# EAGLE design Solar Power Management ESP32 (EAGLE 9.6.2)
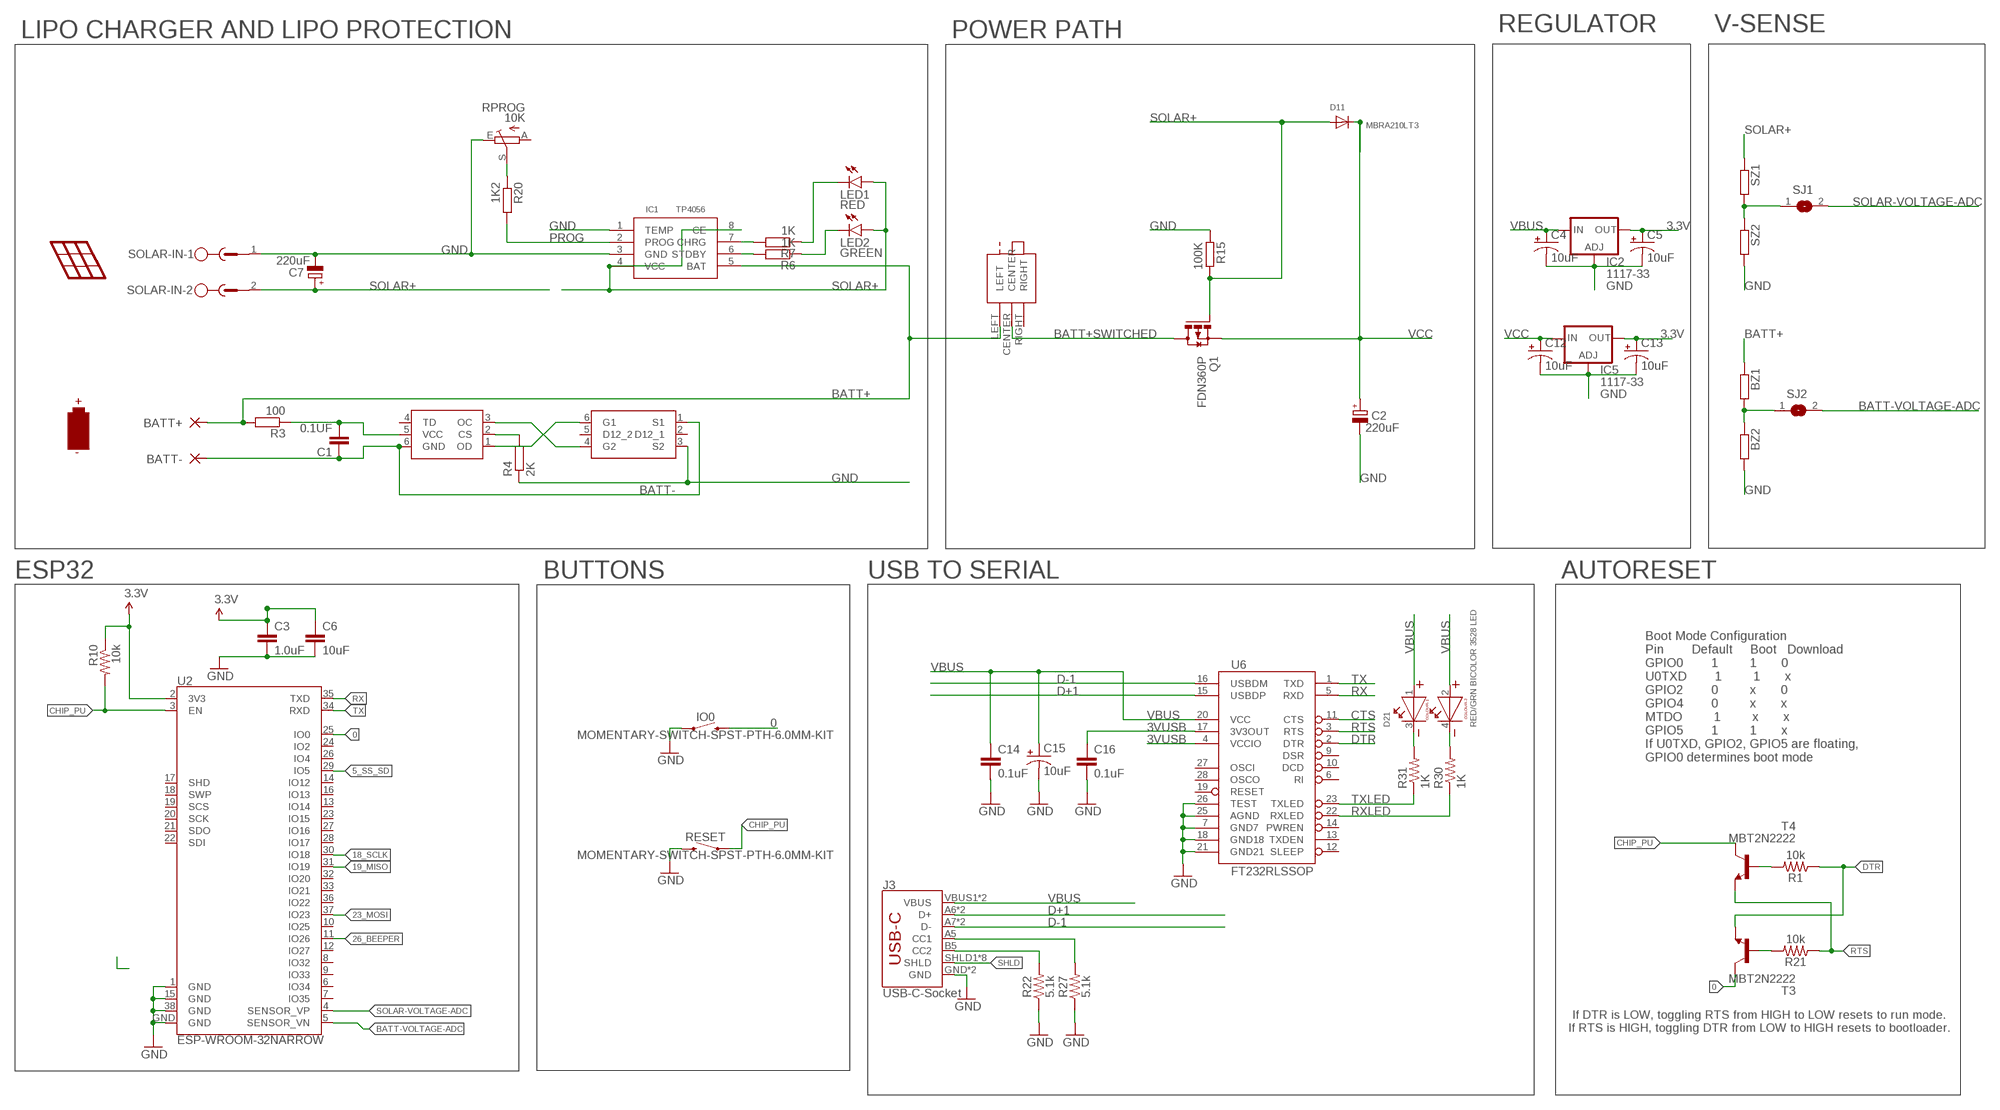
[diagram p0: schematic, sheet 1, part 1 of 2]
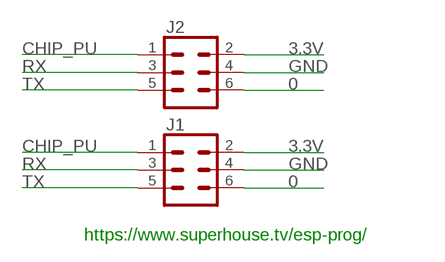
[diagram p1: schematic, sheet 1, part 2 of 2]

## Parts
BATT+  3,81/1,4  [3,81/1,4]
BATT-  3,81/1,4  [3,81/1,4]
BZ1  R-EU_R1206  [R1206]
BZ2  R-EU_R1206  [R1206]
C1  0.1UF  C-EUC1206  [C1206]
C2  220uF  CPOL-EUE3.5-8  [E3,5-8]
C3  1.0uF  1.0UF-1206-50V-10%  [1206]
C4  10uF  CAP_POL1206  [EIA3216]
C5  10uF  CAP_POL1206  [EIA3216]
C6  10uF  10UF-1206-6.3V-20%  [1206]
C7  220uF  CPOL-EUE3.5-8  [E3,5-8]
C12  10uF  CAP_POL1206  [EIA3216]
C13  10uF  CAP_POL1206  [EIA3216]
C14  0.1uF  CAP0603-CAP  [0603-CAP]
C15  10uF  CAP_POL1206  [EIA3216]
C16  0.1uF  CAP0603-CAP  [0603-CAP]
D11  MBRA210LT3  DIODESMA  [SMADIODE]
D21  RED/GRN BICOLOR 3528 LED  WL-SBTW-150141RB73100-R&B  [3528]
IC1  TP4056  [SOP-8]
IC2  1117-33  LD117AS33TR  [SOT223]
IC5  1117-33  LD117AS33TR  [SOT223]
IO0  MOMENTARY-SWITCH-SPST-PTH-6.0MM-KIT  [TACTILE_SWITCH_PTH_6.0MM_KIT]
J1  CONN_03X2SHROUD  [2X3-SHROUDED]
J2  CONN_03X2SHROUD  [2X3-SHROUDED]
J3  USB-C-Socket  USB_C16PIN  [USB-C-16P]
LED1  RED  LEDCHIPLED_1206  [CHIPLED_1206]
LED2  GREEN  LEDCHIPLED_1206  [CHIPLED_1206]
Q1  FDN360P  [SUPER-SOT3]
R1  10k  10KOHM-0603-1/10W-1%  [0603]
R3  100  R-EU_R1206  [R1206]
R4  2K  R-EU_R1206  [R1206]
R6  1K  R-EU_R1206  [R1206]
R7  1K  R-EU_R1206  [R1206]
R10  10k  R-US_R1206  [R1206]
R15  100K  R-EU_R1206  [R1206]
R20  1K2  R-EU_R1206  [R1206]
R21  10k  10KOHM-0603-1/10W-1%  [0603]
R22  5.1k  5.1KOHM5.1KOHM-0603-1/10W-1%  [0603@1]
R27  5.1k  5.1KOHM5.1KOHM-0603-1/10W-1%  [0603@1]
R30  1K  RESISTOR0603-RES  [0603-RES]
R31  1K  RESISTOR0603-RES  [0603-RES]
RESET  MOMENTARY-SWITCH-SPST-PTH-6.0MM-KIT  [TACTILE_SWITCH_PTH_6.0MM_KIT]
RPROG  10K  TRIM_EU-B25P  [B25P]
SJ1  SJ  [SJ]
SJ2  SJ  [SJ]
SOLAR-IN  MSTBV2  [MSTBV2]
SZ1  R-EU_R1206  [R1206]
SZ2  R-EU_R1206  [R1206]
T3  MBT2N2222  MMBT2222ALT1-NPN-SOT23-BEC  [SOT23-BEC]
T4  MBT2N2222  MMBT2222ALT1-NPN-SOT23-BEC  [SOT23-BEC]
U2  ESP-WROOM-32NARROW  [ESP-WROOM-32-NARROW]
U6  FT232RLSSOP  [SSOP28DB]
U$1  FS312F-G  [SOT23-6]
U$2  FS8205  [SOT23-6]
U$3  XKBENTERPRISESS-12D11G5R  [XKBENTERPRISESS-12D11G5R]

## Nets
0: IO0.3 J1.6 J2.6 T3.C U2.25(IO0)
3.3V: C3.1 C5.A(+) C6.1 C13.A(+) IC2.4(OUT) IC5.4(OUT) J1.2 J2.2 R10.1 U2.2(3V3)
3VUSB: C16.1 U6.4(VCCIO) U6.17(3V3OUT)
5_SS_SD: U2.29(IO5)
18_SCLK: U2.30(IO18)
19_MISO: U2.31(IO19)
23_MOSI: U2.37(IO23)
26_BEEPER: U2.11(IO26)
BATT+: BATT+.1(P) BZ1.1 IC1.5(BAT) R3.2 U$3.LEFT
BATT+SWITCHED: Q1.3(D) U$3.CENTER
BATT-: BATT-.1(P) C1.1 U$1.6(GND) U$2.1(S1)
BATT-VOLTAGE-ADC: BZ1.2 BZ2.1 SJ2.1 SJ2.2 U2.5(SENSOR_VN)
CC1: J3.A5(CC1) R27.2
CC2: J3.B5(CC2) R22.2
CHG: IC1.7(CHRG) R7.2
CHIP_PU: J1.1 J2.1 R10.2 RESET.1 T4.C U2.3(EN)
CTS: U6.11(CTS)
D+1: J3.A6(D+) J3.B6(D+) U6.15(USBDP)
D-1: J3.A7(D-) J3.B7(D-) U6.16(USBDM)
DTR: R1.1 T3.E U6.2(DTR)
GND: BZ2.2 C2.- C3.2 C4.C(-) C5.C(-) C6.2 C7.- C12.C(-) C13.C(-) C14.2 C15.C(-) C16.2 IC1.1(TEMP) IC1.3(GND) IC2.1(ADJ) IC5.1(ADJ) IO0.1 J1.4 J2.4 J3.GND J3.GND2(GND) R4.1 R15.1 R22.1 R27.1 RESET.3 RPROG.E SOLAR-IN.1 SZ2.2 U2.1(GND) U2.15(GND) U2.38(GND) U2.GND U6.7(GND7) U6.18(GND18) U6.21(GND21) U6.25(AGND) U6.26(TEST) U$2.3(S2)
LEDCHR: LED1.C R7.1
LEDSBY: LED2.C R6.1
N$1: R4.2 U$1.2(CS)
N$4: R1.2 T4.B
N$6: R21.2 T3.B
N$7: D21.4(C2) R30.2
N$9: D21.3(C1) R31.2
N$12: R20.1 RPROG.S
OC: U$1.3(OC) U$2.4(G2)
OD: U$1.1(OD) U$2.6(G1)
PROG: IC1.2(PROG) R20.2
RTS: R21.1 T4.E U6.3(RTS)
RX: J1.3 J2.3 U2.35(TXD) U6.5(RXD)
RXLED: R30.1 U6.22(RXLED)
SHLD: J3.SHLD1(SHLD) J3.SHLD2(SHLD) J3.SHLD3(SHLD) J3.SHLD4(SHLD) J3.SHLD5(SHLD) J3.SHLD6(SHLD) J3.SHLD7(SHLD) J3.SHLD8(SHLD)
SOLAR+: C7.+ D11.A IC1.4(VCC) IC1.8(CE) LED1.A LED2.A Q1.1(G) R15.2 SOLAR-IN.2 SZ1.1
SOLAR-VOLTAGE-ADC: SJ1.1 SJ1.2 SZ1.2 SZ2.1 U2.4(SENSOR_VP)
STANDBY: IC1.6(STDBY) R6.2
TX: J1.5 J2.5 U2.34(RXD) U6.1(TXD)
TXLED: R31.1 U6.23(TXLED)
VBUS: C4.A(+) C14.1 C15.A(+) D21.1(A1) D21.2(A2) IC2.3(IN) J3.VBUS1(VBUS) J3.VBUS2(VBUS) U6.20(VCC)
VCC: C2.+ C12.A(+) D11.C IC5.3(IN) Q1.2(S)
VCC-PROT: C1.2 R3.1 U$1.5(VCC)
Unconnected: RPROG.A U2.6(IO34) U2.7(IO35) U2.8(IO32) U2.9(IO33) U2.10(IO25) U2.12(IO27) U2.13(IO14) U2.14(IO12) U2.16(IO13) U2.17(SHD) U2.18(SWP) U2.19(SCS) U2.20(SCK) U2.21(SDO) U2.22(SDI) U2.23(IO15) U2.24(IO2) U2.26(IO4) U2.27(IO16) U2.28(IO17) U2.32(IO20) U2.33(IO21) U2.36(IO22) U6.6(RI) U6.9(DSR) U6.10(DCD) U6.12(SLEEP) U6.13(TXDEN) U6.14(PWREN) U6.19(RESET) U6.27(OSCI) U6.28(OSCO) U$1.4(TD) U$2.2(D12_1) U$2.5(D12_2) U$3.RIGHT

## Notes on the sheet
- LIPO CHARGER AND LIPO PROTECTION | POWER PATH | REGULATOR | V-SENSE
- https://www.superhouse.tv/esp-prog/
- +
- -
- ESP32 | BUTTONS | USB TO SERIAL | AUTORESET
- Boot Mode Configuration
  Pin        Default     Boot   Download
  GPIO0        1         1       0
  U0TXD        1         1       x
  GPIO2        0         x       0
  GPIO4        0         x       x
  MTDO         1         x       x
  GPIO5        1         1       x
  If U0TXD, GPIO2, GPIO5 are floating, 
  GPIO0 determines boot mode
- If DTR is LOW, toggling RTS from HIGH to LOW resets to run mode.
  If RTS is HIGH, toggling DTR from LOW to HIGH resets to bootloader.

## Library data of the parts
BATT+ BATT- = wirepad:3,81/1,4: THROUGH-HOLE PAD
BZ1 BZ2 R3 R4 R6 R7 R15 R20 SZ1 SZ2 = rcl:R-EU_: RESISTOR, European symbol; SPICEPREFIX: R
C1 = rcl:C-EU: CAPACITOR, European symbol; SPICEPREFIX: C
C2 C7 = resistor:CPOL-EU: POLARIZED CAPACITOR, European symbol
C3 = SparkFun-Capacitors:1.0UF: 1µF ceramic capacitors A capacitor is a passive two-terminal electrical component used to store electrical energy temporarily in an electric field.; PROD_ID: CAP-09822
C4 C5 C12 C13 C15 = SparkFun:CAP_POL: Capacitor Polarized These are standard SMD and PTH capacitors. Normally 10uF, 47uF, and 100uF in electrolytic and tantalum varieties. Always verify the external diameter of the through hole cap, it varies with capacity, voltage, and manufacturer. The EIA devices should be standard.
C6 = SparkFun-Capacitors:10UF: 10.0µF ceramic capacitors A capacitor is a passive two-terminal electrical component used to store electrical energy temporarily in an electric field.; PROD_ID: CAP-10057
C14 C16 = SparkFun:CAP: Capacitor Standard 0603 ceramic capacitor, and 0.1" leaded capacitor.
D11 = microbuilder:DIODE: Diode SMADIODE - SMA Surface Mount Package 20V 1A Schottky Diode Digikey (500mV @ 1A, 500uA Vr @ 20V): 641-1014-6-ND 10V 2A Schottky Diode Digikey (350mV @ 2A, 700uA Vr @ 10V): MBRA210LT3 SOD-123 30V 200mA (800mV Vf, 2uA Vr @ 25V) Schottky Diode (very fast switching for boost, etc.) - Digikey: BAT54T1GOSTR-ND 30V 500mA (430mV Vf, 130uA Vr @ 30V) Schottky Diode - Digikey: B0530W-FDICT-ND MBR120 1A 20V (0.34Vf) Schottky Diode - Digikey: MBR120VLSFT1GOSCT-ND SOD-323 10V 570mA (380mV Vf, 3ns) Schottky Diode - Digikey: ZLLS410CT-ND 1N4148WS - 75V 150mA (1V Vf @ 10mA, 4ns) Simple Diode - Digikey: 1N4148WSFSCT-ND, Mouser: 512-1N4148WS SOD-523 BAT54 30V 200mA Schottky (0.8 Vf @ 100mA, 5ns) - Digikey: BAT54XV2CT-ND 30V 30mA Schottky Diode (RB751S-40TE61) - Digikey: RB751S-40TE61CT-ND SOT23-R/W - SOT23 Package (R = Solder Paste/Reflow Ovens, W = Hand-Soldering) BAT54Film 40V 300mA - Digikey: 497-7162-1-ND DO-1N4148 Through Hole Small Current Diode (any model)
D21 = Wurth_Elektronik_Optoelectronics_rev15c:WL-SBTW: SMD bi-color TOP LED Characteristics Low energy consumption High reliability Low current requirement Fast switching No UV/IR radiation None diffused lens Black surface Compact package outline Applications Flat backlight for LCDs, switches and symbols Decorative lighting <http://katalog.we-online.de/media/images/eipal/WL-SBTW_pf2.jpg> Details see: http://katalog.we-online.de/en/led/WL-SBTW?m Updated 2015-04-10 2015 (C) Wurth Elektronik; COMPANY-URL: http://www.we-online.de; CREATED-BY: Christin Otto; CREATED-DATE: APR 2013; DATASHEET-URL: http://katalog.we-online.de/en/led/WL-SBTW?m=t&sq=sbtw&sp=&sp=http%3A%2F%2Fwww.we-online.de%2Fweb%2Fen%2Felectronic_components%2Fsearchpage_PBS.php%3Fsearch%3Dsbtw#vs_t2:2; MANUFACTURER: Würth Elektronik eiSos GmbH
IC1 = TP4056:TP4056
IC2 IC5 = v-reg:LD117A?*: Low drop fixed and adjustable positive voltage regulators 1 A Source: http://www.st.com/stonline/products/literature/ds/7194/ld1117axx.pdf
IO0 RESET = SparkFun-Switches:MOMENTARY-SWITCH-SPST: Momentary Switch (Pushbutton) - SPST Normally-open (NO) SPST momentary switches (buttons, pushbuttons). Variants PTH-12MM - 12mm square, through-hole Momentary Pushbutton Switch - 12mm Square <https://www.sparkfun.com/products/9190> (COM-09190) PTH-6.0MM, PTH-6.0MM-KIT - 6.0mm square, through-hole Mini Pushbutton Switch <https://www.sparkfun.com/products/97> (COM-00097) KIT package intended for soldering kit's - only one side of pads' copper is exposed. PTH-RIGHT-ANGLE-KIT - Right-angle, through-hole Right Angle Tactile Button <https://www.sparkfun.com/products/10791> - Used on SparkFun BigTime Watch Kit <https://www.sparkfun.com/products/11734> SMD-12MM - 12mm square, surface-mount Tactile Button - SMD (12mm) <https://www.sparkfun.com/products/12993> (COM-12993) Used on SparkFun PicoBoard <https://www.sparkfun.com/products/11888> SMD-4.5MM - 4.5mm Square Trackball Switch Used on SparkFun Blackberry Trackballer Breakout <https://www.sparkfun.com/products/13169> SMD-4.6MMX2.8MM - 4.60mm x 2.80mm, surface mount Used on SparkFun SAMD21 Mini Breakout <https://www.sparkfun.com/products/13664> SMD-5.2MM, SMD-5.2-REDUNDANT - 5.2mm square, surface-mount Mini Pushbutton Switch - SMD <https://www.sparkfun.com/products/8720> (COM-08720) Used on Arduino Pro Mini <https://www.sparkfun.com/products/11114> REDUNDANT package connects both switch circuits together SMD-6.0X3.5MM - 6.0 x 3.5mm, surface mount Momentary Reset Switch SMD <https://www.sparkfun.com/products/8229> (COM-08229) SMD-6.2MM-TALL - 6.2mm square, surface mount Tactile Button - SMD (6mm) <https://www.sparkfun.com/products/12992> Used on SparkFun Digital Sandbox <https://www.sparkfun.com/products/12651> SMD-RIGHT-ANGLE - Right-angle, surface mount Used on SparkFun Block for Intel® Edison - Arduino <https://www.sparkfun.com/products/13036>; PROD_ID: SWCH-08441; SF_SKU: COM-00097
J1 J2 = SparkFun-Connectors2:CONN_03X2: Multi connection point. Often used as Generic Header-pin footprint for 0.1 inch spaced/style header connections You can populate with any combo of single row headers, but if you'd like an exact match, check these: Header - 2x3 (Male, 0.1") <https://www.sparkfun.com/products/12807> (PRT-12807) Header - 2x3 (Female, 0.1") <https://www.sparkfun.com/products/13010> (PRT-13010) 2x3 Pin Shrouded Header <https://www.sparkfun.com/products/10877> (PRT-10877) On any of the 0.1 inch spaced packages, you can populate with these: Break Away Headers - Straight <https://www.sparkfun.com/products/116> (PRT-00116) Break Away Male Headers - Right Angle <https://www.sparkfun.com/products/553> (PRT-00553) Female Headers <https://www.sparkfun.com/products/115> (PRT-00115) Break Away Headers - Machine Pin <https://www.sparkfun.com/products/117> (PRT-00117) Break Away Female Headers - Swiss Machine Pin <https://www.sparkfun.com/products/743> (PRT-00743) Special note: the shrouded connector mates well with our 3x2 ribbon cables: Ribbon Crimp Connector - 6-pin (2x3, Female) <https://www.sparkfun.com/products/10651> (PRT-10651) Ribbon Cable - 6 wire (15ft) <https://www.sparkfun.com/products/10646> (PRT-10646); PROD_ID: CONN-10681; SF_ID: PRT_10877
J3 = SparkFun-Connectors:USB_C: USB Type C 16Pin Connector Super Speed pins not available on the 16-pin purely SMD connector so this part is best for USB 2.0 implementations. D1 and D2 are tied together enabling D+/- no matter which way the cable is plugged into the connector. The two channel configuration pins (CC1/2) are exposed. These are normally connected to ground via 5.1k resistors but can be reconfigured for high current/high power applications.; PROD_ID: CONN-14122
LED1 LED2 = led:LED: LED OSRAM: - CHIPLED LG R971, LG N971, LY N971, LG Q971, LY Q971, LO R971, LY R971 LH N974, LH R974 LS Q976, LO Q976, LY Q976 LO Q996 - Hyper CHIPLED LW Q18S LB Q993, LB Q99A, LB R99A - SideLED LS A670, LO A670, LY A670, LG A670, LP A670 LB A673, LV A673, LT A673, LW A673 LH A674 LY A675 LS A676, LA A676, LO A676, LY A676, LW A676 LS A679, LY A679, LG A679 - Hyper Micro SIDELED® LS Y876, LA Y876, LO Y876, LY Y876 LT Y87S - SmartLED LW L88C, LW L88S LB L89C, LB L89S, LG L890 LS L89K, LO L89K, LY L89K LS L896, LA L896, LO L896, LY L896 - TOPLED LS T670, LO T670, LY T670, LG T670, LP T670 LSG T670, LSP T670, LSY T670, LOP T670, LYG T670 LG T671, LOG T671, LSG T671 LB T673, LV T673, LT T673, LW T673 LH T674 LS T676, LA T676, LO T676, LY T676, LB T676, LH T676, LSB T676, LW T676 LB T67C, LV T67C, LT T67C, LS T67K, LO T67K, LY T67K, LW E67C LS E67B, LA E67B, LO E67B, LY E67B, LB E67C, LV E67C, LT E67C LW T67C LS T679, LY T679, LG T679 LS T770, LO T770, LY T770, LG T770, LP T770 LB T773, LV T773, LT T773, LW T773 LH T774 LS E675, LA E675, LY E675, LS T675 LS T776, LA T776, LO T776, LY T776, LB T776 LHGB T686 LT T68C, LB T68C - Hyper Mini TOPLED® LB M676 - Mini TOPLED Santana® LG M470 LS M47K, LO M47K, LY M47K Source: http://www.osram.convergy.de LUXEON: - LUMILED® LXK2-PW12-R00, LXK2-PW12-S00, LXK2-PW14-U00, LXK2-PW14-V00 LXK2-PM12-R00, LXK2-PM12-S00, LXK2-PM14-U00 LXK2-PE12-Q00, LXK2-PE12-R00, LXK2-PE12-S00, LXK2-PE14-T00, LXK2-PE14-U00 LXK2-PB12-K00, LXK2-PB12-L00, LXK2-PB12-M00, LXK2-PB14-N00, LXK2-PB14-P00, LXK2-PB14-Q00 LXK2-PR12-L00, LXK2-PR12-M00, LXK2-PR14-Q00, LXK2-PR14-R00 LXK2-PD12-Q00, LXK2-PD12-R00, LXK2-PD12-S00 LXK2-PH12-R00, LXK2-PH12-S00 LXK2-PL12-P00, LXK2-PL12-Q00, LXK2-PL12-R00 Source: www.luxeon.com KINGBRIGHT: KA-3528ASYC Source: www.kingbright.com
Q1 = transistor-power:FDN360P: Single P-Channel, PowerTrench (R) MOSFET Source: http://www.fairchildsemi.com/ds/FD/FDN360P.pdf
R1 R21 = SparkFun-Resistors:10KOHM: 10kΩ resistor A resistor is a passive two-terminal electrical component that implements electrical resistance as a circuit element. Resistors act to reduce current flow, and, at the same time, act to lower voltage levels within circuits. - Wikipedia; PROD_ID: RES-00824
R10 = adafruit:R-US_: RESISTOR, American symbol
R22 R27 = SparkFun-Resistors:5.1KOHM; PROD_ID: RES-12083
R30 R31 = SparkFun:RESISTOR: Resistor Basic schematic elements and footprints for 0603, 1206, and PTH resistors.
RPROG = pot:TRIM_EU-: POTENTIOMETER
SJ1 SJ2 = jumper:SJ: SMD solder JUMPER
SOLAR-IN = con-phoenix-500:MSTBV2: PHOENIX; OC_FARNELL: unknown; OC_NEWARK: unknown
T3 T4 = transistor:*-NPN-: NPN Transistror BF959 corrected 2008.03.06
U2 = SparkFun-RF:ESP-WROOM-32; PROD_ID: IC-13849
U6 = SparkFun:FT232RL: USB UART FT232RL 4th Generation USB UART (USB <-> Serial) Controller. Spark Fun Electronics SKU : COM-00650
U$1 = buckboost:FS312F-G
U$2 = buckboost:FS8205
U$3 = XKB Enterprise SS-12D11G5R:XKBENTERPRISESS-12D11G5R

## Net classes
0 default: width 0.254 mm, clearance 0.152 mm

## Board
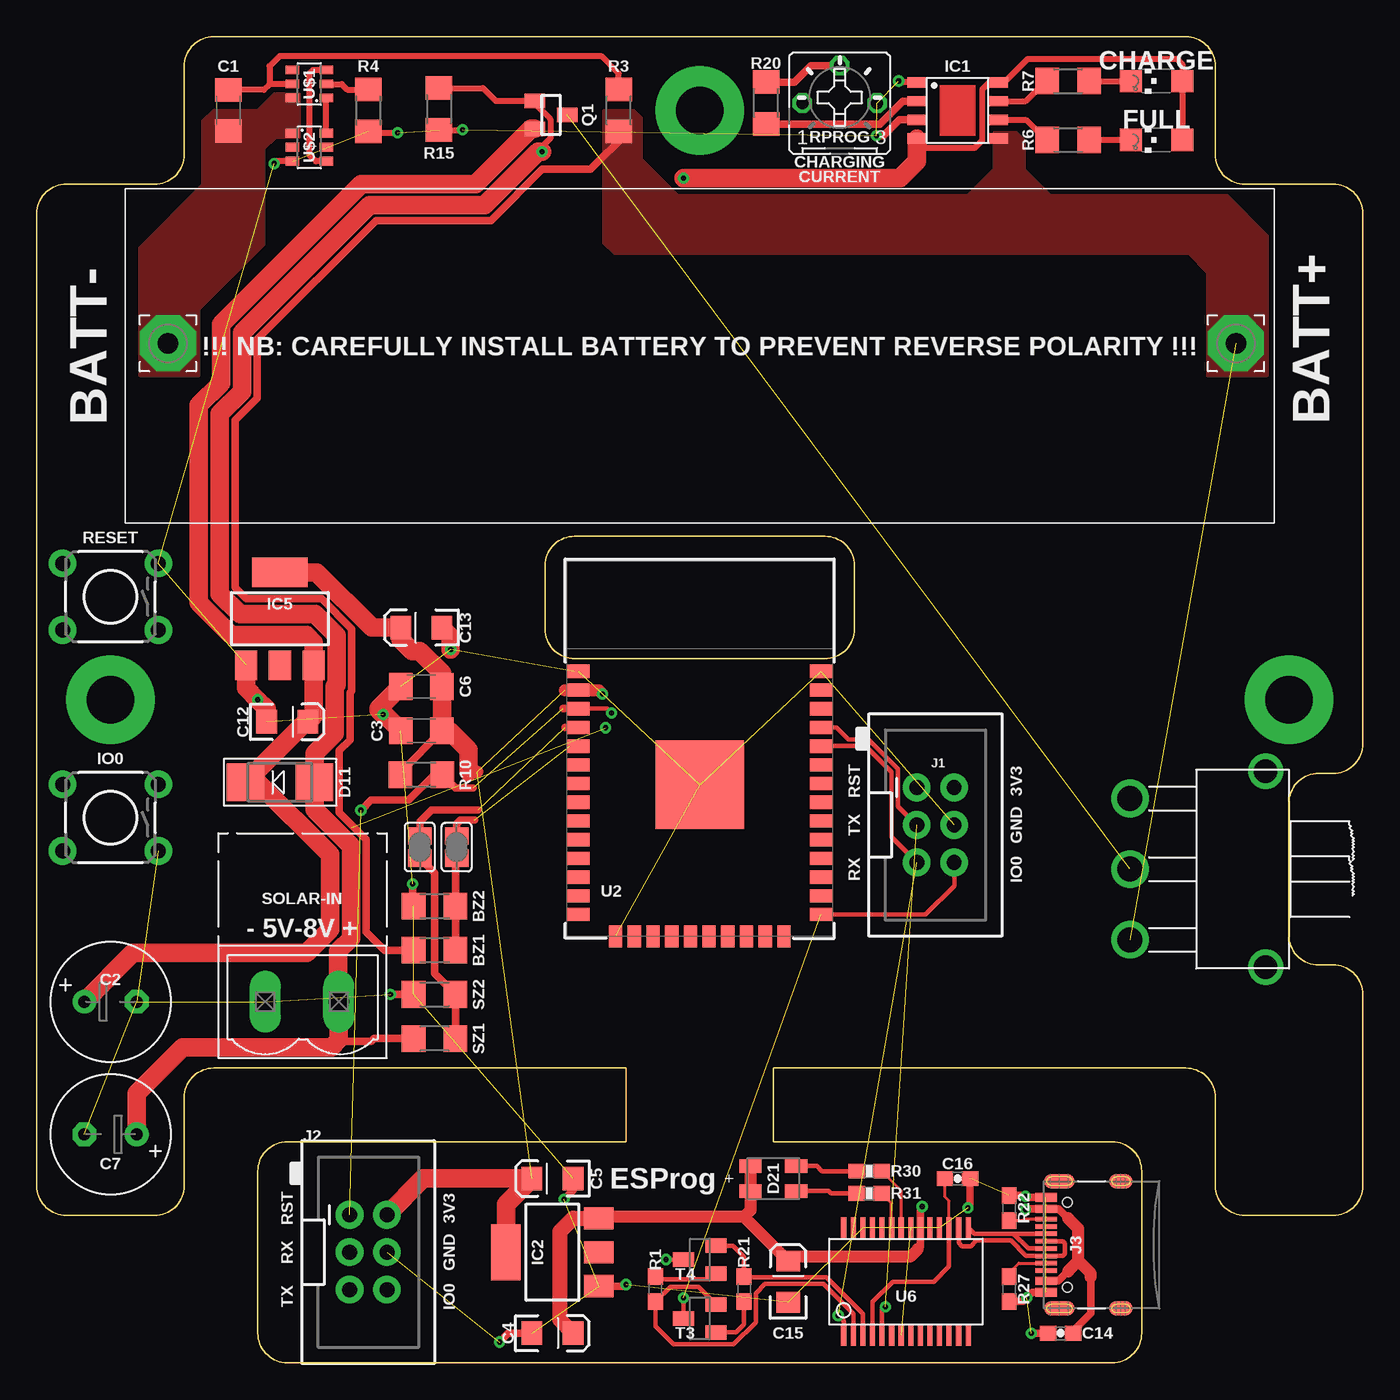
[diagram p2: board, top side]
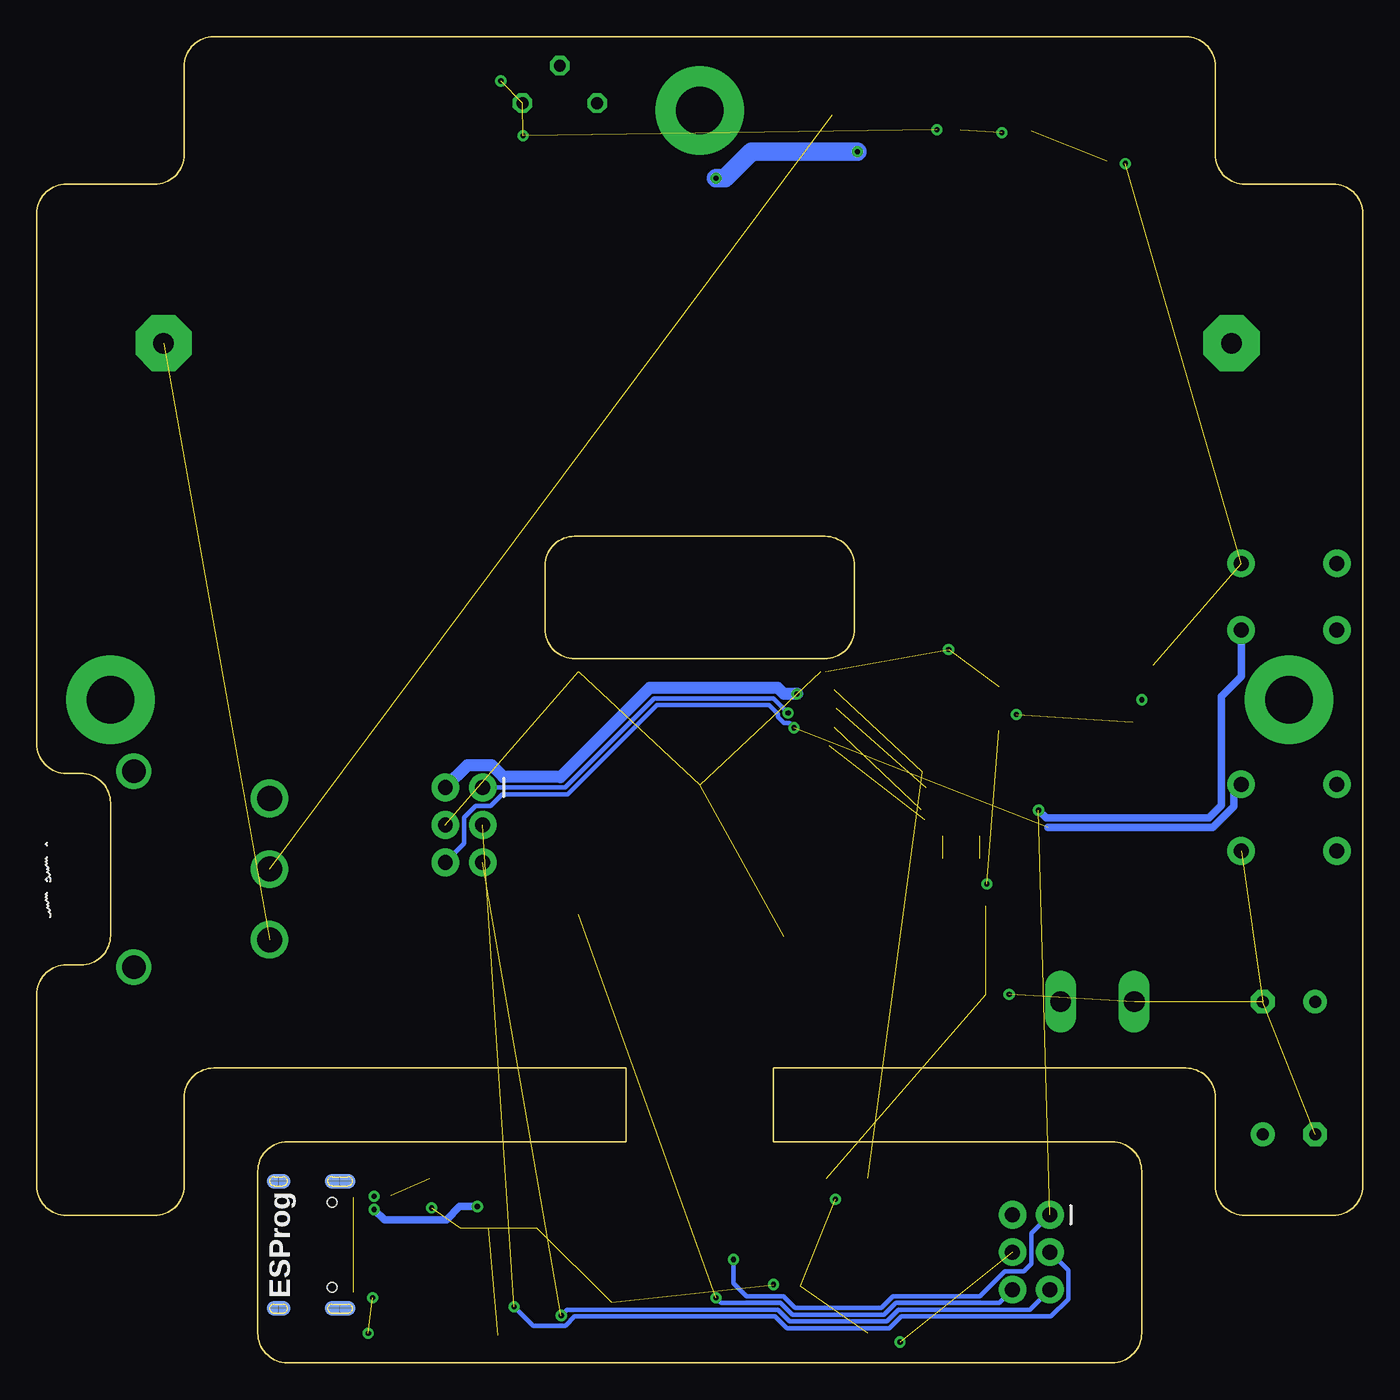
[diagram p3: board, bottom side, seen from below]

Size 90 x 90 mm. Coordinates in mm from the lower left corner, seen from the top.
Outline: 10,82 10,88 arc-90 12,90 78,90 arc-90 80,88 80,82 arc90 82,80 88,80 arc-90 90,78 90,42 arc-90 88,40 87,40 arc90 85,38 85,29 arc90 87,27 88,27 arc-90 90,25 90,12 arc-90 88,10 82,10 arc-90 80,12 80,18 arc90 78,20 50,20 50,15 73,15 arc-90 75,13 75,2 arc-90 73,0 17,0 arc-90 15,2 15,13 arc-90 17,15 40,15 40,20 12,20 arc90 10,18 10,12 arc-90 8,10 2,10 arc-90 0,12 0,78 arc-90 2,80 8,80 arc90 10,82
Outline: 36.5,47.8 arc-90 34.5,49.8 34.5,54.1 arc-90 36.5,56.1 53.5,56.1 arc-90 55.5,54.1 55.5,49.8 arc-90 53.5,47.8 36.5,47.8
Copper layers (1*16): Top 0.035mm / dielectric 1.5mm / Bottom 0.035mm
Design rules "default *": minimum track width 6mil, minimum drill 0.35mm, track to track 6mil, track to pad 6mil, pad to pad 6mil, via to via 6mil, smd to smd 6mil, copper to edge 10mil, drill to drill 6mil, minimum pad ring 10mil, minimum via ring 8mil, stop-mask expansion 4mil, vias tented up to drill 0mil, thermal gap 10mil

### Footprints (pad centres in the part's own frame; a part is rotated, then mirrored left to right if it is on the bottom)
3,81/1,4 = drill 1.397 pad 3.81 octagon: 1 0,0
R1206 = smd 1.6 x 1.803: 1 -1.422,0; 2 1.422,0
C1206 = smd 1.6 x 1.8: 1 -1.4,0; 2 1.4,0
E3,5-8 = drill 0.813 pad 1.6: + -1.778,0 | drill 0.813 pad 1.6 octagon: - 1.778,0
1206 = smd 1.6 x 1.8: 1 -1.4,0; 2 1.4,0
EIA3216 = smd 1.4 x 1.6: A 1.4,0; C -1.4,0
0603-CAP = smd 1.1 x 1: 1 -0.85,0; 2 0.85,0
SMADIODE = smd 2.54 x 2.54: A 2.349,0; C -2.349,0
3528 = smd 1.5 x 0.9: 1 1.55,0.85; 2 1.55,-0.85; 3 -1.55,0.85; 4 -1.55,-0.85
SOP-8 = smd 1.3 x 0.7: 1 -2.75,1.905; 2 -2.75,0.635; 3 -2.75,-0.635; 4 -2.75,-1.905; 5 2.75,-1.905; 6 2.75,-0.635; 7 2.75,0.635; 8 2.75,1.905
SOT223 = smd 1.5 x 2: 1 -2.3,-3.15; 2 0,-3.15; 3 2.3,-3.15 | smd 3.8 x 2: 4 0,3.15
TACTILE_SWITCH_PTH_6.0MM_KIT = drill 1.016 pad 1.88: 1 -3.251,2.261; 2 3.251,2.261; 3 -3.251,-2.261; 4 3.251,-2.261
2X3-SHROUDED = drill 1.016 pad 1.88: 1 -1.27,2.54; 2 1.27,2.54; 3 -1.27,0; 4 1.27,0; 5 -1.27,-2.54; 6 1.27,-2.54
USB-C-16P = smd 0.3 x 1.45: A5 -1.25,0; A6 -0.25,0; A7 0.25,0; A8 1.25,0; B5 1.75,0; B6 0.75,0; B7 -0.75,0; B8 -1.75,0 | smd 0.6 x 1.45: GND -3.225,0; GND2 3.225,0 | smd 1 x 2.1: SHLD1 -4.32,-0.915; SHLD2 4.32,-0.915 | smd 1 x 2.1 bottom: SHLD3 -4.32,-0.915; SHLD4 4.32,-0.915 | smd 1 x 1.6: SHLD5 -4.32,-5.095; SHLD8 4.32,-5.095 | smd 1 x 1.6 bottom: SHLD6 -4.32,-5.095; SHLD7 4.32,-5.095 | smd 0.55 x 1.45: VBUS1 -2.45,0; VBUS2 2.45,0 | hole 0.65: -2.89,-1.445; 2.89,-1.445
CHIPLED_1206 = smd 1.5 x 1.5: A 0,-1.75; C 0,1.75
SUPER-SOT3 = smd 1 x 1.4: 1 -0.95,-1.1; 2 0.95,-1.1; 3 0,1.1
0603 = smd 1.1 x 1: 1 -0.85,0; 2 0.85,0
0603@1 = smd 1.1 x 1: 1 -0.85,0; 2 0.85,0
0603-RES = smd 1.1 x 1: 1 -0.85,0; 2 0.85,0
B25P = drill 0.813 octagon: A -2.54,0; E 2.54,0; S 0,2.54
SJ = smd 1.168 x 1.6: 1 -0.762,0; 2 0.762,0
MSTBV2 = drill 1.397 long: 1 -2.5,0; 2 2.5,0
SOT23-BEC = smd 1 x 1.4: B -0.95,-1.1; C 0,1.1; E 0.95,-1.1
ESP-WROOM-32-NARROW = smd 0.9 x 1.5: 1 6.43,8.238; 2 5.16,8.238; 3 3.89,8.238; 4 2.62,8.238; 5 1.35,8.238; 6 0.08,8.238; 7 -1.19,8.238; 8 -2.46,8.238; 9 -3.73,8.238; 10 -5,8.238; 11 -6.27,8.238; 12 -7.54,8.238; 13 -8.81,8.238; 14 -10.08,8.238; 25 -10.08,-8.238; 26 -8.81,-8.238; 27 -7.54,-8.238; 28 -6.27,-8.238; 29 -5,-8.238; 30 -3.73,-8.238; 31 -2.46,-8.238; 32 -1.19,-8.238; 33 0.08,-8.238; 34 1.35,-8.238; 35 2.62,-8.238; 36 3.89,-8.238; 37 5.16,-8.238; 38 6.43,-8.238 | smd 1.5 x 0.9: 15 -11.57,5.715; 16 -11.57,4.445; 17 -11.57,3.175; 18 -11.57,1.905; 19 -11.57,0.635; 20 -11.57,-0.635; 21 -11.57,-1.905; 22 -11.57,-3.175; 23 -11.57,-4.445; 24 -11.57,-5.715 | smd 6 x 6: GND -1.27,0
SSOP28DB = smd 0.348 x 1.397: 1 -4.225,-3.656; 2 -3.575,-3.656; 3 -2.925,-3.656; 4 -2.275,-3.656; 5 -1.625,-3.656; 6 -0.975,-3.656; 7 -0.325,-3.656; 8 0.325,-3.656; 9 0.975,-3.656; 10 1.625,-3.656; 11 2.275,-3.656; 12 2.925,-3.656; 13 3.575,-3.656; 14 4.225,-3.656; 15 4.225,3.656; 16 3.575,3.656; 17 2.925,3.656; 18 2.275,3.656; 19 1.625,3.656; 20 0.975,3.656; 21 0.325,3.656; 22 -0.325,3.656; 23 -0.975,3.656; 24 -1.625,3.656; 25 -2.275,3.656; 26 -2.925,3.656; 27 -3.575,3.656; 28 -4.225,3.656
SOT23-6 = smd 0.6 x 0.9: 1 -0.95,-1.15; 2 0,-1.15; 3 0.95,-1.15; 4 0.95,1.15; 5 0,1.15; 6 -0.95,1.15
XKBENTERPRISESS-12D11G5R = drill 1.7: CENTER 0,-10.8; LEFT 4.8,-10.8; RIGHT -4.8,-10.8 | drill 1.6: P$1 -6.65,-1.58; P$2 6.65,-1.58

### Placement (x,y rotation side)
BATT+  81.4,69.2 0 top
BATT-  8.9,69.2 0 top
BZ1  27,28 0 top
BZ2  27,31 180 top
C1  13,85 90 top
C2  5,24.5 0 top
C3  26.1,42.9 180 top
C4  35,2 0 top
C5  35,12.5 180 top
C6  26.1,45.9 180 top
C7  5,15.5 180 top
C12  17,43.5 0 top
C13  26.1,49.9 180 top
C14  69.5,2 180 top
C15  51,5.5 90 top
C16  62.5,12.5 0 top
D11  16.5,39.4 0 top
D21  50,12.5 180 top
IC1  62.5,85 0 top
IC2  35,7.5 90 top
IC5  16.5,50.5 0 top
IO0  5,37 180 top
J1  61,36.5 0 top
J2  22.5,7.5 0 top
J3  68.5,8 90 top
LED1  76,87 90 top
LED2  76,83 90 top
Q1  34.9,84.7 270 top
R1  42,5 90 top
R3  39.5,85 270 top
R4  22.5,85 90 top
R6  70,83 180 top
R7  70,87 180 top
R10  26.1,39.9 0 top
R15  27.3,85.1 90 top
R20  49.5,85.5 270 top
R21  48,5 270 top
R22  66,10.5 270 top
R27  66,5 90 top
R30  56.5,13 180 top
R31  56.5,11.5 180 top
RESET  5,52 180 top
RPROG  54.5,85.5 0 top
SJ1  26,35 90 top
SJ2  28.5,35 90 top
SOLAR-IN  18,24.5 0 top
SZ1  27,22 0 top
SZ2  27,25 180 top
T3  45,3 90 top
T4  45,7 90 top
U2  45,40.5 90 top
U6  59,5.5 0 top
U$1  18.5,86.8 90 top
U$2  18.5,82.5 270 top
U$3  85,33.5 270 top

### Tracks (layer width: path | path; a pad name or v marks a point on that pad's centre or on a via)
0  (via drill 0.35)  (2 unrouted)
  Top 0.305: T3.C v43.9,4.4 | U2.25 60.32,30.42 62.27,32.37 J1.6
  Bottom 0.305: v43.9,4.4 43.56,4.06 39.51,4.06 38.71,3.26 32.49,3.26 31.69,4.06 24.67,4.06 J2.6 | J1.6 61,35.23 61,37 60.2,37.8 59.21,37.8 58.43,38.58 53.97,38.58 47.91,44.64 40.3,44.64 39.68,44.03 39.68,43.82 39.28,43.42 38.92,43.42 v38.6,43.1
  Bottom 0.508: IO0.3 8.75,38.76 8.75,37.75 10.19,36.31 21.39,36.31
3.3V  (via drill 0.35)  (2 unrouted)
  Top 0.508: R10.1 24.68,40.08 C3.1
  Top 0.813: v38.4,45.4 38.14,45.66 U2.2 35.84,45.66 | 29.3,40.1 29.9,40.1
  Top 1.016: 28,42.9 C3.1
  Top 1.27: 29.3,40.1 29.3,41.6 28,42.9 | C3.1 C6.1 27.5,46.8 25.99,48.31 25.47,48.31 24.7,49.09 C13.A 22.76,49.9 19.01,53.65 IC5.4 | IC2.4 31.85,10.75 C5.A 26.23,12.5 J2.2
  Bottom 0.813: v38.4,45.4 39.29,45.4 39.7,45.81 48.4,45.81 54.45,39.75 58.32,39.75 59.11,40.54 60.77,40.54 J1.2
3VUSB
  Top 0.203: U6.17 61.92,10.97 61.65,11.25 C16.1
  Top 0.305: U6.4 56.73,4.12 58.1,5.5 60.9,5.5 61.92,6.53 U6.17
BATT+  (1 unrouted)
  Top 0.508: BZ1.1 23.6,28 22.36,29.24 22.36,35.52 20.53,37.36 20.53,41.54 21.26,42.28 21.26,45.48 21.38,45.59 21.38,49.81 19.32,51.86 14.22,51.86 13.46,52.62 13.46,63.98 14.96,65.48 14.96,69.48 23.02,77.54 30.82,77.54 34.28,81 37.6,81 40.1,83.5 40.1,83.6 39.52,83.6 R3.2
  pour Top (no thermals): 38.5,85 40.5,85 41,84.5 41,81.7 43.5,79.2 63.2,79.2 65,81 65,83.5 66.5,83.5 67,83 67,81 68.8,79.2 80.8,79.2 83.5,76.5 83.5,67 79.5,67 79.5,74 78.2,75.3 39.2,75.3 38.5,76
BATT+SWITCHED  (1 unrouted)
BATT-
  pour Top (no thermals): 7,67 7,75.7 11.3,80 11.3,84.3 12,85 15,85 16.1,86.1 17.8,86.1 17.8,83.2 16.2,83.2 15.4,82.4 15.4,75.9 11,71.5 11,67
BATT-VOLTAGE-ADC  (2 unrouted)
  Top 0.508: BZ1.2 BZ2.1 28.42,34.16 SJ2.1 | 28.76,35.76 SJ2.2 28.5,36.56 28.77,36.83 29.73,36.83 | 36.76,42 U2.5 36.2,41.85
CC1
  Top 0.203: R27.2 66,6.1 66.65,6.75 J3.A5
CC2
  Top 0.203: R22.2 66.95,9.65 67.05,9.75 J3.B5
CHG
  Top 0.406: IC1.7 67.14,85.64 68.5,87 R7.2
CHIP_PU  (via drill 0.35)  (2 unrouted)
  Top 0.305: v42.7,7 T4.C | v39,44.1 38.71,44.39 U2.3
  Top 0.508: 29.62,39 28.42,39 R10.2 26.95,39.9 25.25,38.19 22.69,38.19 v22,37.5 | 35.73,44.39 U2.3
  Bottom 0.305: J2.1 22.5,8.77 22.5,6.7 23,6.21 24.29,6.21 25.98,4.51 31.88,4.51 32.68,3.71 38.52,3.71 39.32,4.51 41.81,4.51 42.7,5.4 v42.7,7 | J1.1 54.16,39.04 48.1,45.1 40,45.1 v39,44.1
  Bottom 0.508: v22,37.5 21.48,36.98 10.46,36.98 9.6,37.84 9.6,45.22 8.25,46.57 RESET.1
D+1
  Top 0.305: J3.B6 66.3,8.75 | 66.3,8.75 63.63,8.75 U6.15 | J3.A6 67.3,7.75 66.3,8.75
D-1
  Top 0.305: J3.A7 69.65,8.25 69.8,8.1 69.8,7.4 69.65,7.25 J3.B7 67.15,7.25 66.11,8.29 63.79,8.29 63.4,7.9 62.8,7.9 62.58,8.12 U6.16
DTR
  Top 0.305: U6.2 55.42,3.33 53.41,5.34 49.44,5.34 48.8,4.71 48.8,2.76 47.29,1.25 43.22,1.25 42,2.47 R1.1 43,5.15 44.9,5.15 T3.E
GND  (via drill 0.35)  (34 unrouted)
  Top 0.406: R4.1 22.58,83.5 v24.5,83.5 | U$2.3 16.25,81.55 v16.1,81.4 | IC1.1 58.59,86.91 v58.5,87 | R15.1 28.88,83.68 v28.9,83.7
  Top 0.508: IC1.3 58.55,84.36 57.48,83.29 v57,83.29 | U2.1 36.47,46.93 | BZ2.2 25.5,31.08 v25.5,32.5 | SZ2.2 v24,25 | C16.2 63.35,10.65 v63.2,10.5 | R22.1 67.05,11.35 v67.1,11.3 67.17,11.22 J3.GND2 | J3.GND 67.58,4.78 v67.2,4.4 66.95,4.15 R27.1 | C14.2 v67.5,2 | C4.C 32,2 v31.4,1.4 | v40,5.3 39.9,5.2 IC2.1 | C5.C 36.4,11.7 v35.8,11.1
  Top 1.27: C12.C 15.6,44.4 v15,45 14.2,45.8 IC5.1 | C3.2 23.2,44.4 | 23.2,44.4 23.2,44.3 v23.5,44 | C6.2 23.2,44.4 | C13.C 28.1,49.3 v28.1,48.4
LEDCHR
  Top 0.406: R7.1 LED1.C
LEDSBY
  Top 0.406: LED2.C R6.1
N$1
  Top 0.406: U$1.2 20.7,86.8 21.08,86.42 R4.2
N$3  (via drill 3.2 pad 6)
  other vias: 45,85
N$4
  Top 0.305: R1.2 42.2,5.65 45.7,5.65 T4.B
N$6
  Top 0.305: R21.2 48,2.6 47.45,2.05 T3.B
N$7
  Top 0.305: D21.4 52.95,13.35 53.3,13 R30.2
N$8  (via drill 3.2 pad 6)
  other vias: 85,45
N$9
  Top 0.305: D21.3 53.75,11.65 53.9,11.5 R31.2
N$10  (via drill 3.2 pad 6)
  other vias: 5,45
N$12
  Top 0.508: R20.1 51.42,86.92 52.54,88.04 RPROG.S
OC
  Top 0.406: U$2.4 18.95,81.55 18.5,82 18.5,87.5 18.75,87.75 U$1.3
OD
  Top 0.406: U$2.6 U$1.1
PROG
  Top 0.508: IC1.2 58.78,85.64 57.23,84.08 R20.2
RTS
  Top 0.305: U6.3 56.08,3.33 53.6,5.8 48.05,5.8 R21.1 48,7.2 47.25,7.95 T4.E
RX  (via drill 0.35)  (1 unrouted)
  Top 0.305: U6.5 57.38,3.58 v57.6,3.8 | J1.3 58.46,37.77 58.46,40.29 56.44,42.31 55.09,42.31 54.28,43.12 U2.35
  Bottom 0.305: v57.6,3.8 56.32,2.52 54.12,2.52 53.49,3.14 39.89,3.14 39.09,2.34 32.11,2.34 31.31,3.14 21.16,3.14 19.98,4.32 19.98,6.25 J2.3
RXLED
  Top 0.203: U6.22 58.67,11.68 R30.1
SOLAR+  (via drill 0.35)
  Top 0.406: IC1.4 60.4,82.44 63.65,82.44 64.16,82.95 64.16,86.4 64.66,86.91 IC1.8 65.68,86.91 67.27,88.5 77.4,88.5 77.75,88.15 LED1.A LED2.A | 34.01,82.2 34.01,82.26 34.86,83.1 34.86,84.4 33.8,85.45 Q1.1 31.15,85.65 30.28,86.52 R15.2
  Top 0.508: SZ1.1 22.9,22 22.7,21.8 20.6,21.8 20.5,21.9
  Top 1.27: C7.+ 6.78,18.28 9.9,21.4 20,21.4 20.5,21.9 SOLAR-IN.2 20.46,24.54 20.46,27.94 21.32,28.81 21.32,35.09 18.85,37.56 D11.A 18.85,41.34 20.22,42.71 20.22,45.91 20.34,46.02 20.34,49.37 18.89,50.82 13.79,50.82 12.42,52.19 12.42,64.41 13.92,65.91 13.92,69.91 22.59,78.58 30.39,78.58 34.01,82.2 v34.3,82.2 | v43.9,80.4 58.6,80.4 59.75,81.55 IC1.4
  Bottom 1.27: v34.3,82.2 41.5,82.2 43.3,80.4 v43.9,80.4
SOLAR-VOLTAGE-ADC  (2 unrouted)
  Top 0.508: SJ1.1 27,33.24 27,26.42 SZ2.1 SZ1.2 | 26.16,35.76 SJ1.2 26,36.73 26.8,37.53 29.96,37.53 | U2.4 35.87,43.12
STANDBY
  Top 0.406: IC1.6 67.14,84.36 68.5,83 R6.2
TX  (via drill 0.35)  (1 unrouted)
  Top 0.305: U6.1 54.77,2.83 v54.4,3.2 | U2.34 56.25,41.85 58,40.1 58,35.69 J1.5
  Bottom 0.305: v54.4,3.2 54,3.6 39.7,3.6 38.9,2.8 32.3,2.8 31.5,3.6 22.59,3.6 J2.5
TXLED
  Top 0.203: U6.23 58.02,10.82 R31.1
VBUS  (via drill 0.35)
  Top 0.508: J3.VBUS1 69.35,5.55 70,6.2 | 69.99,9.81 69.35,10.45 J3.VBUS2 67.16,10.45 v67.1,10.39 | C14.1 70.35,2.15 71.54,3.34 71.54,5.83 | v60.1,10.6 59.98,10.47 U6.20 59.98,7.88 59.8,7.7
  Top 0.813: 70,6.2 70.7,6.9 | 69.99,9.81 70.7,9.1 70.7,6.9 | 71.54,5.83 71.54,6.06 70.7,6.9 | 59.8,7.7 59.3,7.2 51.3,7.2 C15.A 48,9.9 | IC2.3 38.25,9.9 48,9.9 | 48,9.9 48.45,10.35 D21.1 D21.2
  Top 1.016: C4.A 35.5,2.9 35.5,8.9 36.4,9.8 IC2.3
  Bottom 0.508: v60.1,10.6 61.3,10.6 62.2,9.7 66.41,9.7 v67.1,10.39
VCC
  Top 1.27: C2.+ 6.52,27.8 18.3,27.8 19.9,29.4 19.9,34.5 15,39.4 D11.C 18.25,43.5 C12.A 18.8,43.9 IC5.3 18.8,48.9 18.3,49.4 13.2,49.4 11,51.6 11,65 12.5,66.5 12.5,70.5 22,80 29.8,80 33.55,83.75 Q1.2
VCC-PROT
  Top 0.406: U$1.5 15.8,86.8 | C1.2 15.4,86.4 15.8,86.8 | R3.1 39.5,87.5 38.3,88.7 16.5,88.7 15.8,88 15.8,86.8

### Text on the board
tPlace: CHARGE | FULL | CHARGING | CURRENT | !!! NB: CAREFULLY INSTALL BATTERY TO PREVENT REVERSE POLARITY !!! | RST | 3V3 | TX | GND | RX | IO0 | - 5V-8V + | ESProg | RST | 3V3 | RX | GND | TX | IO0
bPlace: ESProg